# EasyEDA schematic analog_digital_easyEDA.json
TITLE: Analog Digital Converter; REV: 1.0; Date: 2020-02-05; Sheet: 1/1; Company: Your Company
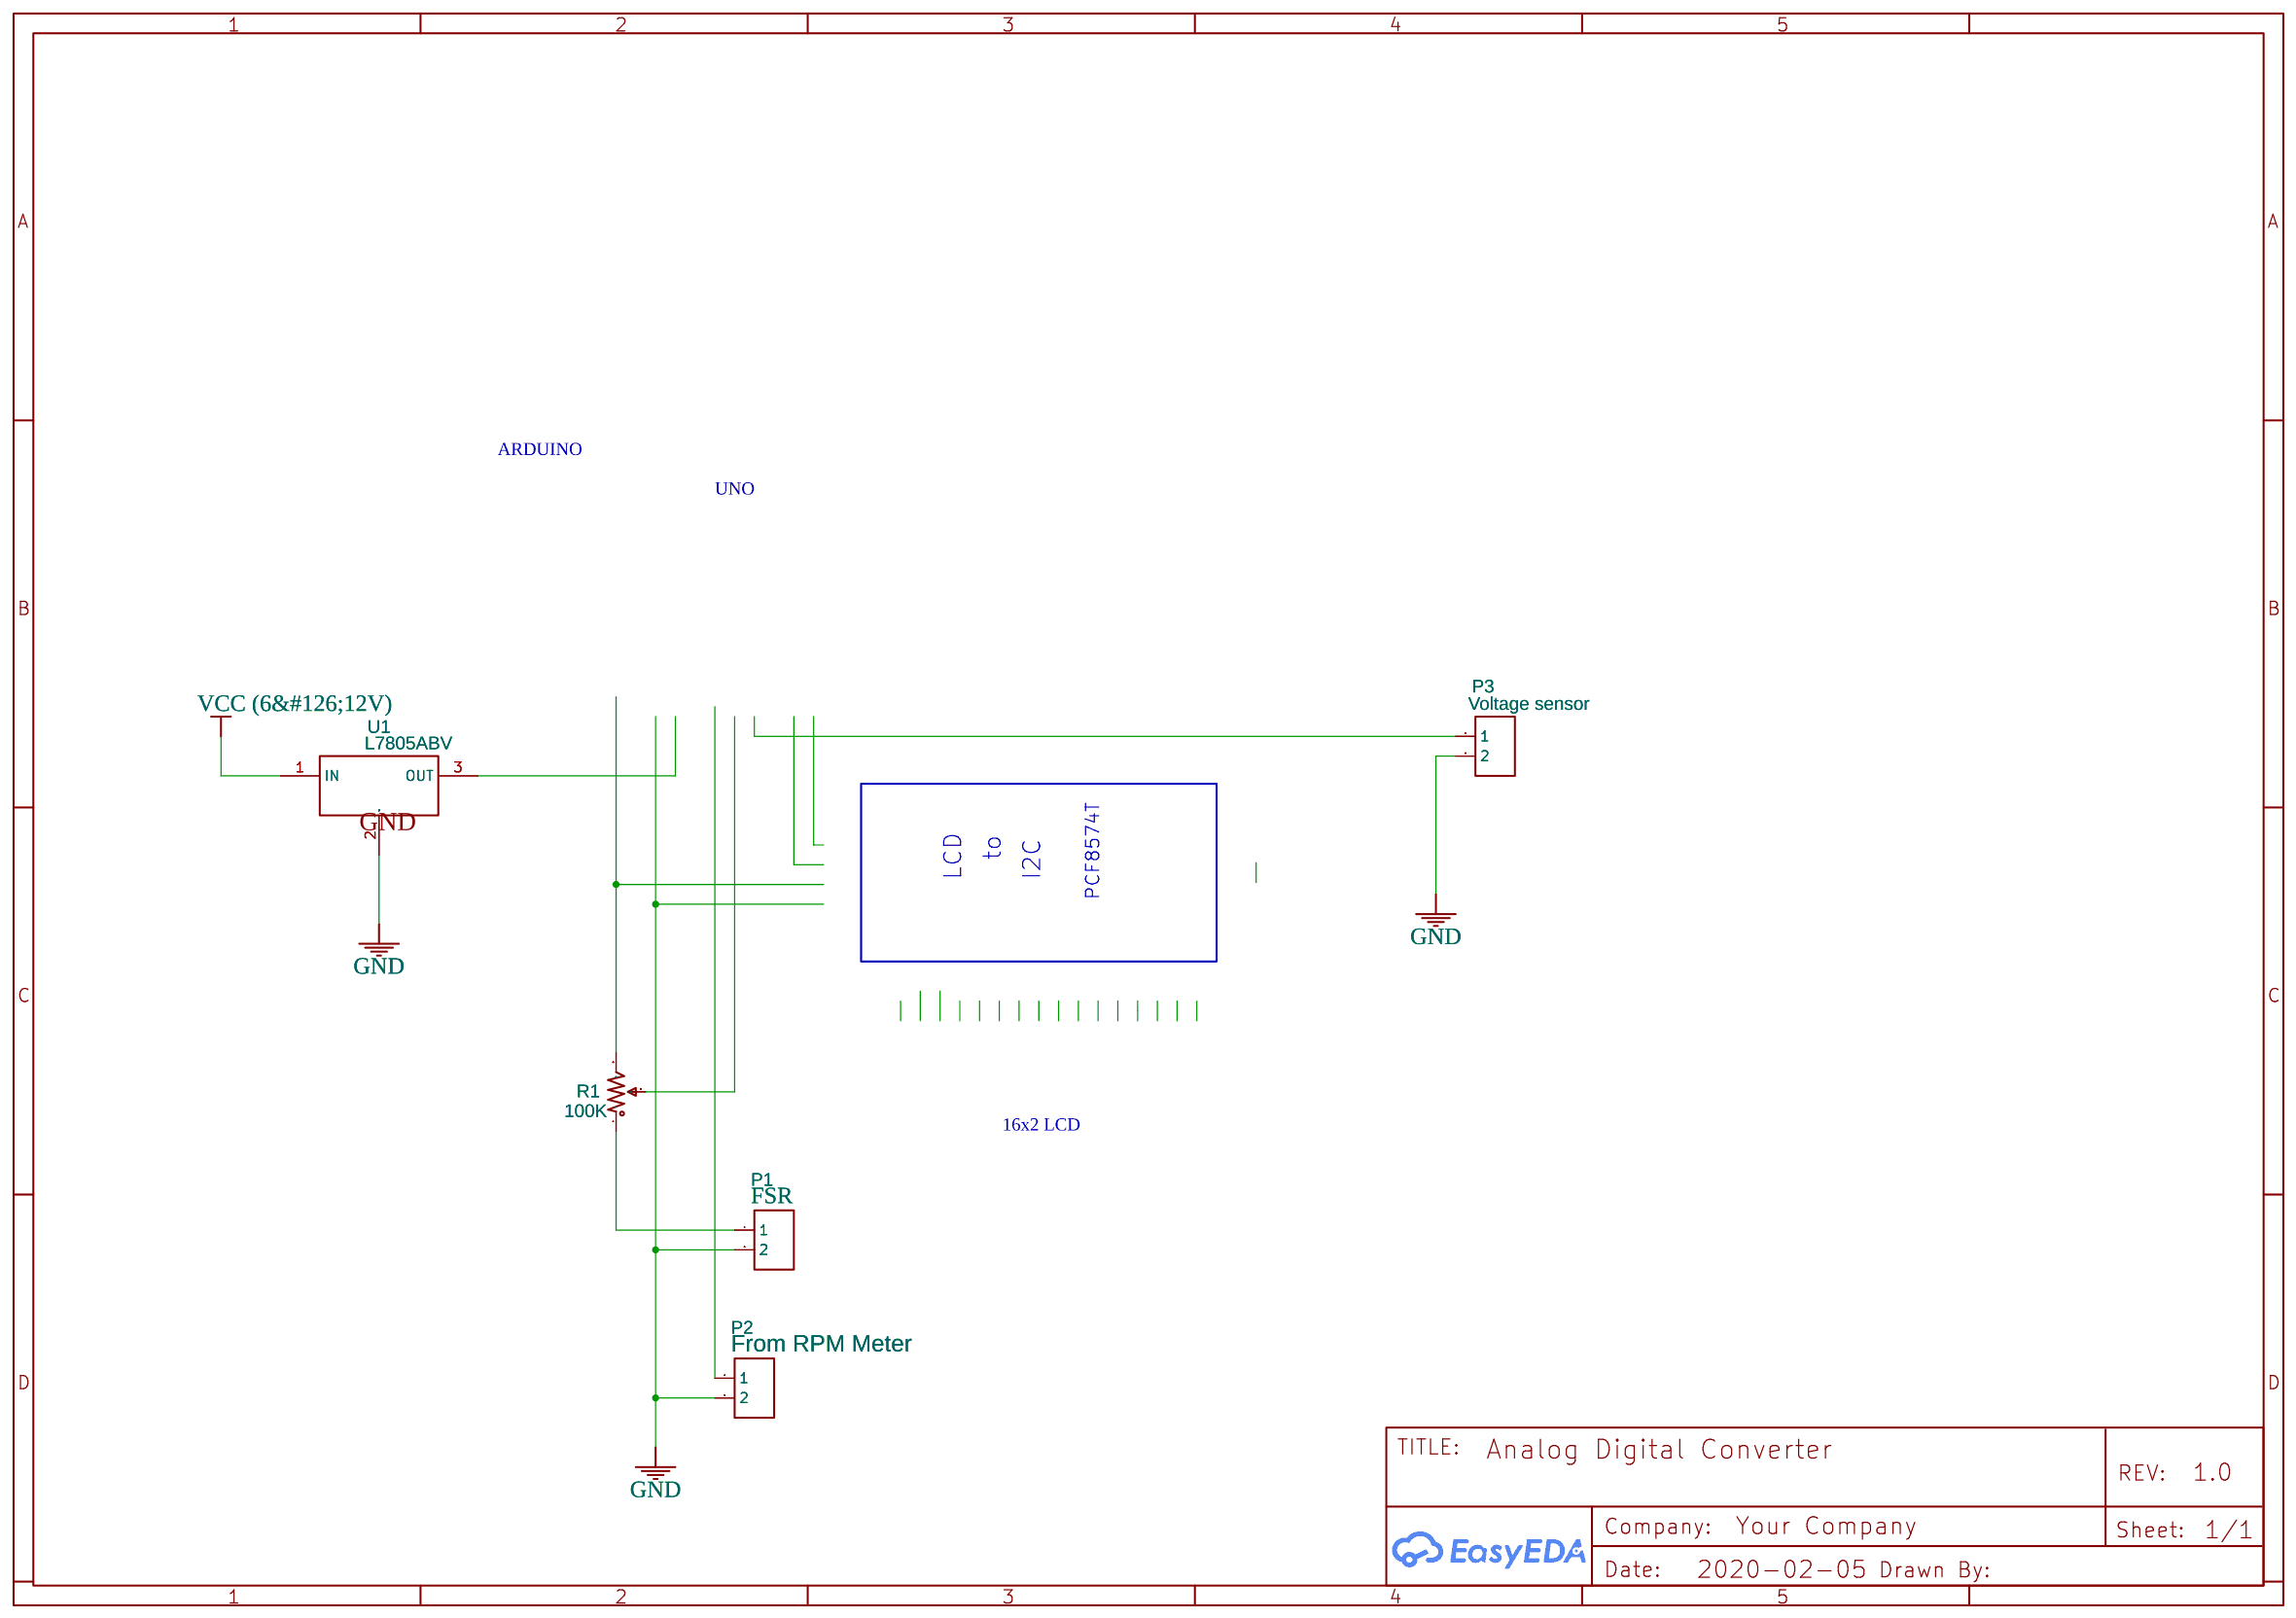
[diagram p0: schematic sheet]

## Parts
#1  -
P1  FSR  [HDR-TH_2P-P2.54-V-M]
P2  From RPM Meter  [HDR-TH_2P-P2.54-V-M]
P3  Voltage sensor  [HDR-TH_2P-P2.54-V-M]
R1  100K  [RES-ADJ_3386P]
U1  L7805ABV  [TO-220(TO-220-3)]

## Library data of the parts
#1 = -: BOM_Manufacturer Part: ?
P1-P3 = Header-Female-2.54_1x2: Supplier: LCSC; Manufacturer: BOOMELE; Manufacturer Part: 2.54-1*2PFemale; image: //image.lceda.cn/szlcsc/C49661.jpg; Supplier Part: C49661
R1 = 3386P-1-101LF_US: Supplier: LCSC; Manufacturer: Bochen; Manufacturer Part: 3386P-1-101LF; Contributor: EasyEDA; Supplier Part: C125022
U1 = L7805ABV: Supplier: LCSC; Manufacturer: STMicroelectronics; image: //image.lceda.cn/szlcsc/C16807.jpg; Supplier Part: C16807

## Nets
GND: P1.2 P2.2 P3.2 U1.2(GND)
VCC (6&#126;12V): U1.1(IN)
Net-(P1-1): P1.1 R1.1

Not connected (* = marked no-connect by the designer): P2 1; P3 1; R1 2 3; U1 3(OUT)

## Notes on the sheet
- ARDUINO
- UNO
- to
- LCD
- I2C
- PCF8574T
- 16x2 LCD
